# Altium project ALU_Add_Shift.PrjPcb
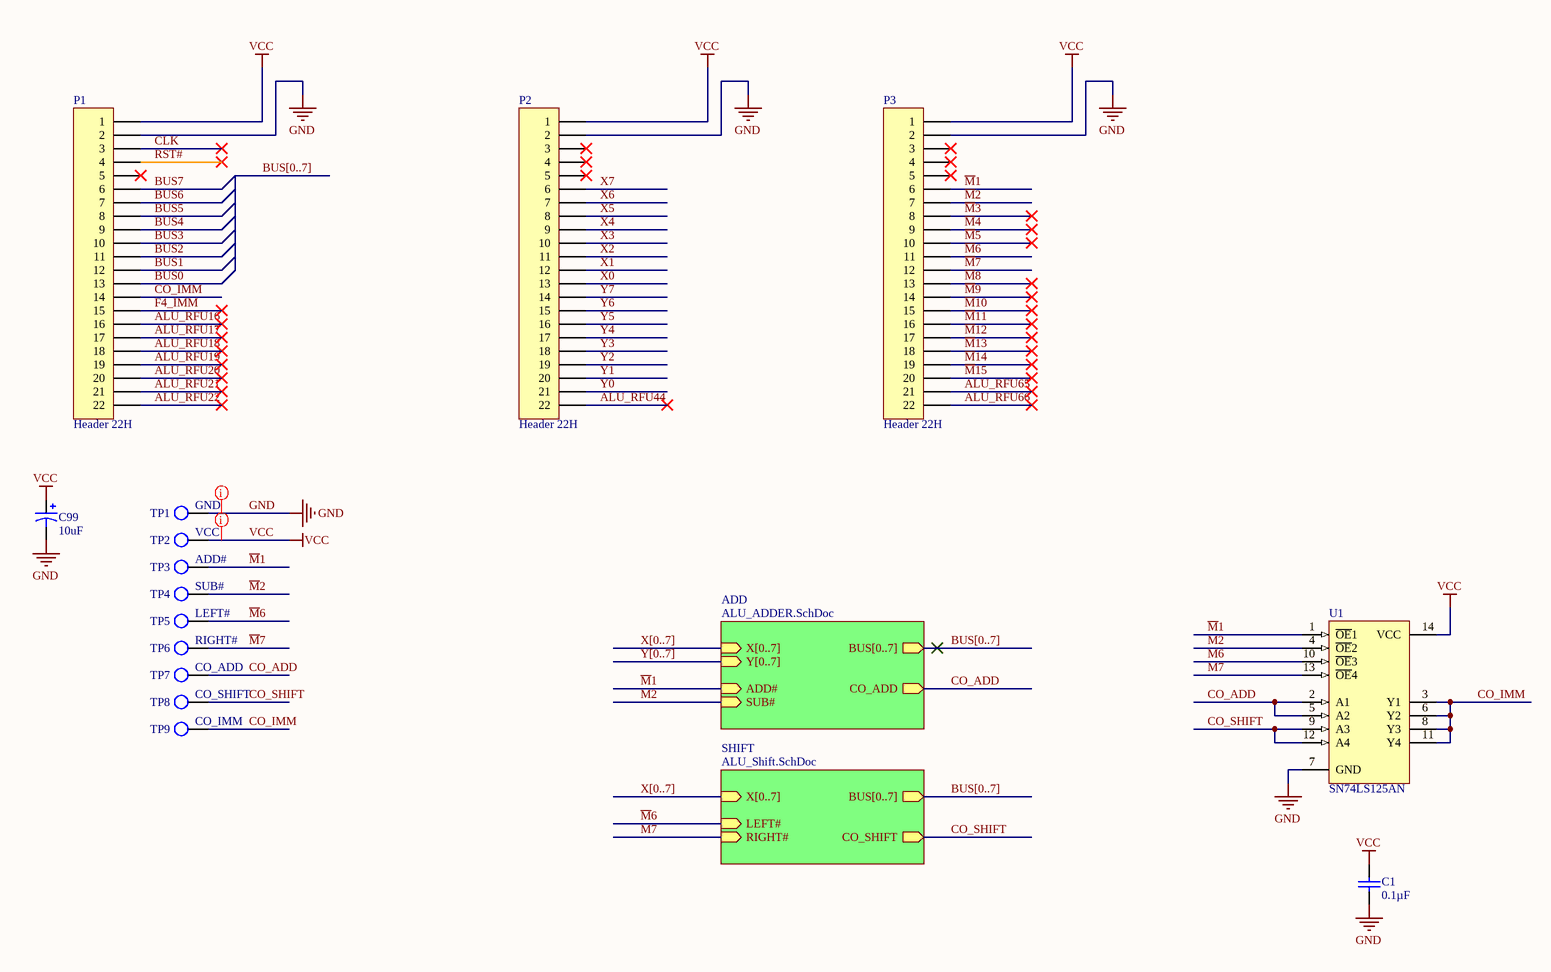
[diagram p0: ALU_Add_Shift.SchDoc]
3 sheets, 43 parts. Net scope: hierarchical (ports join the sheet entries above them; power ports are global).
Board file: ALU_Add_Shift.PcbDoc
Sheets:
  ALU_Add_Shift.SchDoc
    SHIFT = ALU_Shift.SchDoc
    ADD = ALU_ADDER.SchDoc

## Sheet ALU_Add_Shift.SchDoc
size B; Author: E. Sims; Organization: Let's Build Rockets Inc.; SheetNumber: 1; SheetTotal: 3

### Parts
C1  Capacitance: 0.1µF  [VISH-K104K15X7RF5TL2]  (hidden comment: K104K15X7RF5TL2)
C99  value 10uF  [C5x7]  (hidden comment: Cap Pol5)
P1  Header 22H  [HDR1X22H]
P2  Header 22H  [HDR1X22H]
P3  Header 22H  [HDR1X22H]
TP1  GND  [KSTN-5011_V]  (no BOM)
TP2  VCC  [KSTN-5011_V]  (no BOM)
TP3  ADD#  [KSTN-5011_V]  (no BOM)
TP4  SUB#  [KSTN-5011_V]  (no BOM)
TP5  LEFT#  [KSTN-5011_V]  (no BOM)
TP6  RIGHT#  [KSTN-5011_V]  (no BOM)
TP7  CO_ADD  [KSTN-5011_V]  (no BOM)
TP8  CO_SHIFT  [KSTN-5011_V]  (no BOM)
TP9  CO_IMM  [KSTN-5011_V]  (no BOM)
U1  SN74LS125AN  [N014]

### Sub-sheets
ADD = ALU_ADDER.SchDoc: X[0..7] (in), BUS[0..7] (out), CO_ADD (out), SUB# (in), ADD# (in), Y[0..7] (in)
SHIFT = ALU_Shift.SchDoc: X[0..7] (in), BUS[0..7] (out), CO_SHIFT (out), RIGHT# (in), LEFT# (in)

### Nets
GND: C1.2 C99.2 P1.2 P2.2 P3.2 TP1.1 U1.7(GND)
VCC: C1.1 C99.1 P1.1 P2.1 P3.1 TP2.1 U1.14(VCC)
ALU_RFU16: P1.16
ALU_RFU17: P1.17
ALU_RFU18: P1.18
ALU_RFU19: P1.19
ALU_RFU20: P1.20
ALU_RFU21: P1.21
ALU_RFU22: P1.22
ALU_RFU44: P2.22
ALU_RFU65: P3.21
ALU_RFU66: P3.22
BUS0: P1.13
BUS1: P1.12
BUS2: P1.11
BUS3: P1.10
BUS4: P1.9
BUS5: P1.8
BUS6: P1.7
BUS7: P1.6
CLK: P1.3
CO_ADD: TP7.1 U1.2(A1) U1.5(A2) ; sheet ADD/CO_ADD
CO_IMM: P1.14 TP9.1 U1.3(Y1) U1.6(Y2) U1.8(Y3) U1.11(Y4)
CO_SHIFT: TP8.1 U1.9(A3) U1.12(A4) ; sheet SHIFT/CO_SHIFT
F4_IMM: P1.15
~{M}1: P3.6 TP3.1 U1.1(~{OE}1) ; sheet ADD/ADD#  [project net ADD#]
~{M}2: P3.7 TP4.1 U1.4(~{OE}2) ; sheet ADD/SUB#
~{M}3: P3.8
~{M}4: P3.9
~{M}5: P3.10
~{M}6: P3.11 TP5.1 U1.10(~{OE}3) ; sheet SHIFT/LEFT#  [project net LEFT#]
~{M}7: P3.12 TP6.1 U1.13(~{OE}4) ; sheet SHIFT/RIGHT#
~{M}8: P3.13
~{M}9: P3.14
~{M}10: P3.15
~{M}11: P3.16
~{M}12: P3.17
~{M}13: P3.18
~{M}14: P3.19
~{M}15: P3.20
RST#: P1.4
X0: P2.13
X1: P2.12
X2: P2.11
X3: P2.10
X4: P2.9
X5: P2.8
X6: P2.7
X7: P2.6
Y0: P2.21
Y1: P2.20
Y2: P2.19
Y3: P2.18
Y4: P2.17
Y5: P2.16
Y6: P2.15
Y7: P2.14

Not connected (* = marked no-connect by the designer): P1 5*; P2 3* 4* 5*; P3 3* 4* 5*

### Buses and harness runs
bus BUS[0..7]
bus BUS[0..7] = sheet ADD/BUS[0..7]
bus BUS[0..7] = sheet SHIFT/BUS[0..7]
bus X[0..7] = sheet ADD/X[0..7]
bus X[0..7] = sheet SHIFT/X[0..7]
bus Y[0..7] = sheet ADD/Y[0..7]

### Layout directives
rule Width Constraint [Pref Width = 20mil    Min Width = 20mil    Max Width = 50mil]; rule Routing Via Style [Pref Size = 35mil    Pref Hole Size = 20mil]; net class PWR: GND, VCC

### Notes on the sheet
- Let's Build Rocket's Inc. Modular Paylaod System Based on TMP-010 Rev
  For more information visit https://github.com/LetsBuildRockets/Modular-Payload-System
  This work is licensed under CC BY-NC 4.0. To view a copy of this license, visit https://creativecommons.org/licenses/by-nc/4.0
- Title
- Size:
- Date:
- Assembly Variant:
- B
- Number:
- Time:
- Revision:
- Sheet
- of
- Author:
- File:

### Library data of the parts
C1 = CMP-2000-06508-1: Ceramic Capacitor, 100 nF, +/- 10%, 50 V, -55 to 125 degC, 2-Pin THD, RoHS, Tape and Reel; Manufacturer: Vishay; Other Names: BC1084CT; Catalog Drawings: Mono-KapSide2-15_5.58Mono-KapSide1_15; Temperature Coefficient: X7R; Voltage - Rated: 50V; Online Catalog: Mono-Kap™Series; Size / Dimension: 0.157"Lx0.098"W(4.00mmx2.50mm); Operating Temperature: -55°C~125°C; Family: CeramicCapacitors; Manufacturer URL: http://www.vishay.com/; Standard Package: 1; Thickness (Max): -; Ratings: -; Datasheet Version: 08/2013; Package Description: 2-Pin Through Hole Device, Body 4 x 2.6 mm; Mounting Type: ThroughHole; Features: -; Lead Spacing: 0.098"(2.50mm); Tolerance: ±10%; Category: Capacitors; Mounting Technology: ThroughHole; Lead Style: Straight; Datasheet URL: http://www.vishay.com/docs/45171/kseries.pdf; Applications: GeneralPurpose; Package / Case: Radial; Height - Seated (Max): 0.220"(5.58mm); Package Reference: K104K15X7RF5TL2; Series: Mono-Kap™K; Packaging: CutTape(CT)
C99 = Cap Pol5: Polarized Capacitor; Published: 8-Jun-2000; LatestRevisionDate: 17-Jul-2002; LatestRevisionNote: Re-released for DXP Platform.; PackageReference: POLAR0.8; Publisher: Altium Limited; PackageDescription: Polarized Capacitor; 2 Leads
P1-P3 = Header 22H: Header, 22-Pin, Right Angle; System: Connector; LatestRevisionDate: 17-Jul-2002; LatestRevisionNote: Re-released for DXP Platform.; Publisher: Altium Limited
TP1-TP9 = TP
U1 = SN74LS125AN: Quadruple Bus Buffer with 3-State Outputs; Published: 8-Jun-2000; LatestRevisionDate: 06-Jun-2005; LatestRevisionNote: Stylized 3D Model Added.; DatasheetVersion: Mar-1988; PackageVersion: Oct-1995; PackageReference: N014; Publisher: Altium Limited; PackageDescription: DIP; 14 Leads; Row Spacing 7.62 mm; Pitch 2.54 mm; ComponentLink1Description: Manufacturer Link; ComponentLink1URL: http://www.ti.com/; ComponentLink2Description: Datasheet; ComponentLink2URL: http://www-s.ti.com/sc/ds/sn74ls126a.pdf

## Sheet ALU_Shift.SchDoc
size B; Author: E. Sims; Organization: Let's Build Rockets Inc.; SheetNumber: 2; SheetTotal: 3
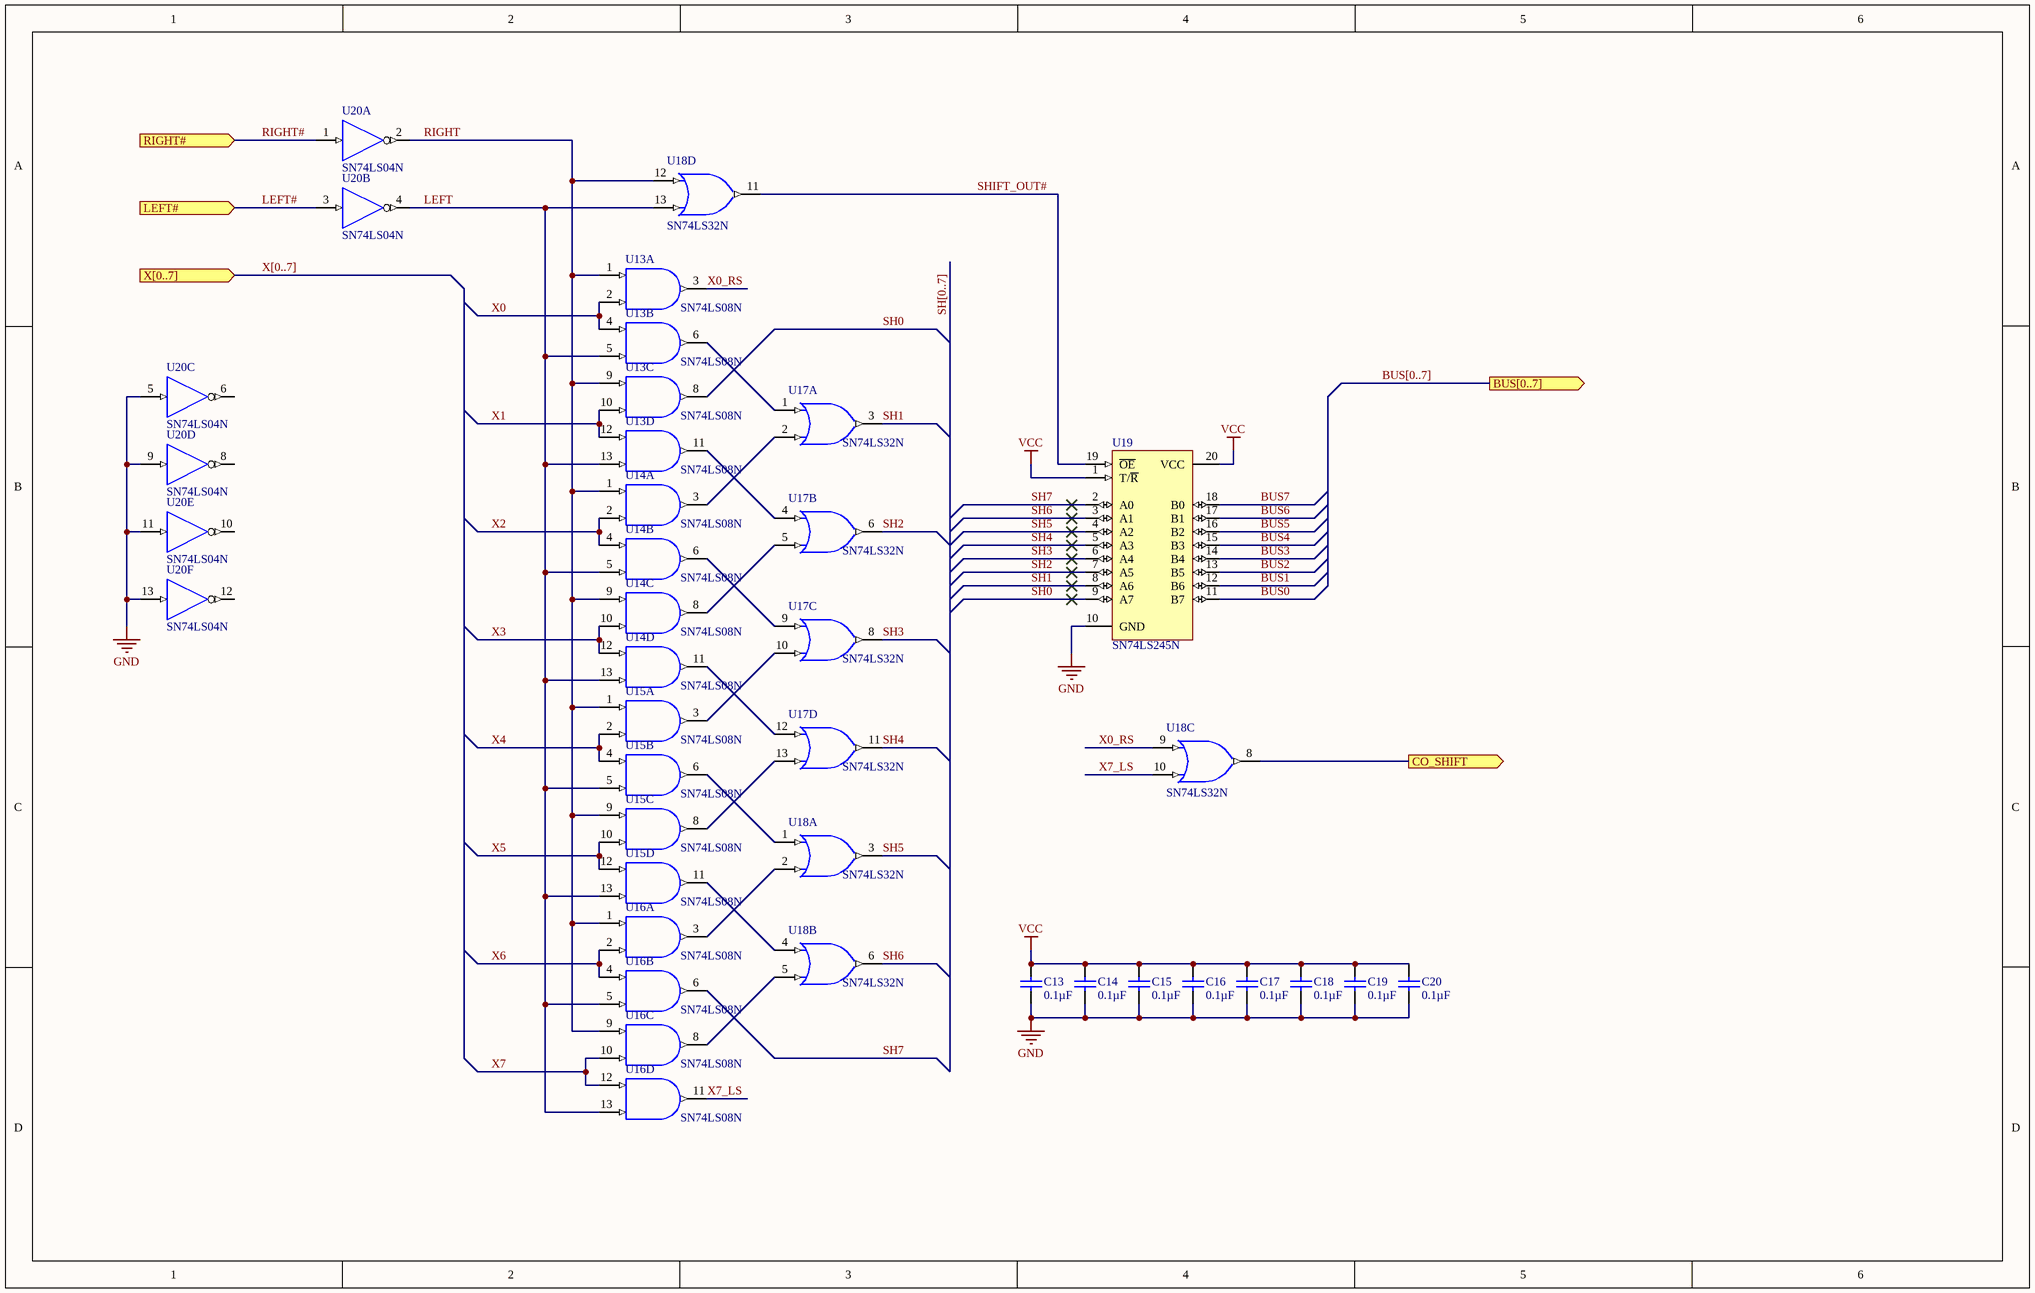
[diagram p1: ALU_Shift.SchDoc]

### Parts
C13  Capacitance: 0.1µF  [VISH-K104K15X7RF5TL2]  (hidden comment: K104K15X7RF5TL2)
C14  Capacitance: 0.1µF  [VISH-K104K15X7RF5TL2]  (hidden comment: K104K15X7RF5TL2)
C15  Capacitance: 0.1µF  [VISH-K104K15X7RF5TL2]  (hidden comment: K104K15X7RF5TL2)
C16  Capacitance: 0.1µF  [VISH-K104K15X7RF5TL2]  (hidden comment: K104K15X7RF5TL2)
C17  Capacitance: 0.1µF  [VISH-K104K15X7RF5TL2]  (hidden comment: K104K15X7RF5TL2)
C18  Capacitance: 0.1µF  [VISH-K104K15X7RF5TL2]  (hidden comment: K104K15X7RF5TL2)
C19  Capacitance: 0.1µF  [VISH-K104K15X7RF5TL2]  (hidden comment: K104K15X7RF5TL2)
C20  Capacitance: 0.1µF  [VISH-K104K15X7RF5TL2]  (hidden comment: K104K15X7RF5TL2)
U13  SN74LS08N  [N014]  (parts A,B,C,D of 4)
U14  SN74LS08N  [N014]  (parts A,B,C,D of 4)
U15  SN74LS08N  [N014]  (parts A,B,C,D of 4)
U16  SN74LS08N  [N014]  (parts A,B,C,D of 4)
U17  SN74LS32N  [N014]  (parts A,B,C,D of 4)
U18  SN74LS32N  [N014]  (parts A,B,C,D of 4)
U19  SN74LS245N  [N020]
U20  SN74LS04N  [N014]  (parts A,B,C,D,E,F of 6)

### Ports
BUS[0..7] (out), CO_SHIFT (out), LEFT# (in), RIGHT# (in), X[0..7] (in)

### Nets
GND: C13.2 C14.2 C15.2 C16.2 C17.2 C18.2 C19.2 C20.2 U13.7(GND) U14.7(GND) U15.7(GND) U16.7(GND) U17.7(GND) U18.7(GND) U19.10(GND) U20.5(A) U20.7(GND) U20.9(A) U20.11(A) U20.13(A)
VCC: C13.1 C14.1 C15.1 C16.1 C17.1 C18.1 C19.1 C20.1 U13.14(VCC) U14.14(VCC) U15.14(VCC) U16.14(VCC) U17.14(VCC) U18.14(VCC) U19.1(T/~{R}) U19.20(VCC) U20.14(VCC)
BUS0: U19.11(B7)
BUS1: U19.12(B6)
BUS2: U19.13(B5)
BUS3: U19.14(B4)
BUS4: U19.15(B3)
BUS5: U19.16(B2)
BUS6: U19.17(B1)
BUS7: U19.18(B0)
CO_SHIFT: U18.8(Y) ; port CO_SHIFT
LEFT: U13.5(B) U13.13(B) U14.5(B) U14.13(B) U15.5(B) U15.13(B) U16.5(B) U16.13(B) U18.13(B) U20.4(Y)
LEFT#: U20.3(A) ; port LEFT#
RIGHT: U13.1(A) U13.9(A) U14.1(A) U14.9(A) U15.1(A) U15.9(A) U16.1(A) U16.9(A) U18.12(A) U20.2(Y)
RIGHT#: U20.1(A) ; port RIGHT#  [project net ~{M}7]
SH0: U13.8(Y) U19.9(A7)
SH1: U17.3(Y) U19.8(A6)
SH2: U17.6(Y) U19.7(A5)
SH3: U17.8(Y) U19.6(A4)
SH4: U17.11(Y) U19.5(A3)
SH5: U18.3(Y) U19.4(A2)
SH6: U18.6(Y) U19.3(A1)
SH7: U16.6(Y) U19.2(A0)
SHIFT_OUT#: U18.11(Y) U19.19(~{OE})
X0: U13.2(B) U13.4(A)
X0_RS: U13.3(Y) U18.9(A)
X1: U13.10(B) U13.12(A)
X2: U14.2(B) U14.4(A)
X3: U14.10(B) U14.12(A)
X4: U15.2(B) U15.4(A)
X5: U15.10(B) U15.12(A)
X6: U16.2(B) U16.4(A)
X7: U16.10(B) U16.12(A)
X7_LS: U16.11(Y) U18.10(B)
NetU13_6: U13.6(Y) U17.1(A)
NetU13_11: U13.11(Y) U17.4(A)
NetU14_3: U14.3(Y) U17.2(B)
NetU14_6: U14.6(Y) U17.9(A)
NetU14_8: U14.8(Y) U17.5(B)
NetU14_11: U14.11(Y) U17.12(A)
NetU15_3: U15.3(Y) U17.10(B)
NetU15_6: U15.6(Y) U18.1(A)
NetU15_8: U15.8(Y) U17.13(B)
NetU15_11: U15.11(Y) U18.4(A)
NetU16_3: U16.3(Y) U18.2(B)
NetU16_8: U16.8(Y) U18.5(B)

Not connected (* = marked no-connect by the designer): U20 6(Y) 8(Y) 10(Y) 12(Y)

### Buses and harness runs
bus BUS[0..7] = port BUS[0..7]
bus SH[0..7]
bus X[0..7] = port X[0..7]

### Notes on the sheet
- Let's Build Rocket's Inc. Modular Paylaod System Based on TMP-010 Rev
  For more information visit https://github.com/LetsBuildRockets/Modular-Payload-System
  This work is licensed under CC BY-NC 4.0. To view a copy of this license, visit https://creativecommons.org/licenses/by-nc/4.0
- Title
- Size:
- Date:
- Assembly Variant:
- B
- Number:
- Time:
- Revision:
- Sheet
- of
- Author:
- File:

### Library data of the parts
C13-C20 = CMP-2000-06508-1: as C1 on sheet ALU_Add_Shift; Size / Dimension: 0.157"Lx0.098"W(4.00mmx2.50mm); Operating Temperature: -55°C~125°C; Family: CeramicCapacitors; Manufacturer URL: http://www.vishay.com/; Standard Package: 1; Thickness (Max): -; Ratings: -; Datasheet Version: 08/2013; Package Description: 2-Pin Through Hole Device, Body 4 x 2.6 mm; Mounting Type: ThroughHole; Features: -; Lead Spacing: 0.098"(2.50mm); Tolerance: ±10%; Category: Capacitors; Mounting Technology: ThroughHole; Lead Style: Straight; Datasheet URL: http://www.vishay.com/docs/45171/kseries.pdf; Applications: GeneralPurpose; Package / Case: Radial; Height - Seated (Max): 0.220"(5.58mm); Package Reference: K104K15X7RF5TL2; Series: Mono-Kap™K; Packaging: CutTape(CT)
U13-U16 = SN74LS08N: Quadruple 2-Input Positive-AND Gate; Published: 8-Jun-2000; LatestRevisionDate: 04-Mar-2005; LatestRevisionNote: Stylized 3D Model Added.; DatasheetVersion: Mar-1988; PackageVersion: Oct-1995; PackageReference: N014; Publisher: Altium Limited; PackageDescription: DIP; 14 Leads; Row Spacing 7.62 mm; Pitch 2.54 mm; ComponentLink1Description: Manufacturer Link; ComponentLink1URL: http://www.ti.com/; ComponentLink2Description: Datasheet; ComponentLink2URL: http://www-s.ti.com/sc/ds/SN74LS08.pdf
U17 U18 = SN74LS32N: Quadruple 2-Input Positive-OR Gate; Published: 8-Jun-2000; LatestRevisionDate: 04-Mar-2005; LatestRevisionNote: Stylized 3D Model Added.; DatasheetVersion: Mar-1988; PackageVersion: Oct-1995; PackageReference: N014; Publisher: Altium Limited; PackageDescription: DIP; 14 Leads; Row Spacing 7.62 mm; Pitch 2.54 mm; ComponentLink1Description: Manufacturer Link; ComponentLink1URL: http://www.ti.com/; ComponentLink2Description: Datasheet; ComponentLink2URL: http://www-s.ti.com/sc/ds/sn74ls32.pdf
U19 = SN74LS245N: Octal Bus Transceiver with 3-State Outputs; Published: 8-Jun-2000; LatestRevisionDate: 04-Mar-2005; LatestRevisionNote: Stylized 3D Model Added.; DatasheetVersion: Mar-1988; PackageVersion: Oct-1995; PackageReference: N020; Publisher: Altium Limited; PackageDescription: DIP; 20 Leads; Row Spacing 7.62 mm; Pitch 2.54 mm; ComponentLink1Description: Manufacturer Link; ComponentLink1URL: http://www.ti.com/; ComponentLink2Description: Datasheet; ComponentLink2URL: http://www-s.ti.com/sc/ds/sn74ls245.pdf
U20 = SN74LS04N: Hex Inverter; Published: 8-Jun-2000; LatestRevisionDate: 04-Mar-2005; LatestRevisionNote: Stylized 3D Model Added.; DatasheetVersion: Mar-1988; PackageVersion: Oct-1995; PackageReference: N014; Publisher: Altium Limited; PackageDescription: DIP; 14 Leads; Row Spacing 7.62 mm; Pitch 2.54 mm; ComponentLink1Description: Manufacturer Link; ComponentLink1URL: http://www.ti.com/; ComponentLink2Description: Datasheet; ComponentLink2URL: http://www-s.ti.com/sc/ds/sn74ls04.pdf

## Sheet ALU_ADDER.SchDoc
size B; Author: E. Sims; Organization: Let's Build Rockets Inc.; SheetNumber: 3; SheetTotal: 3
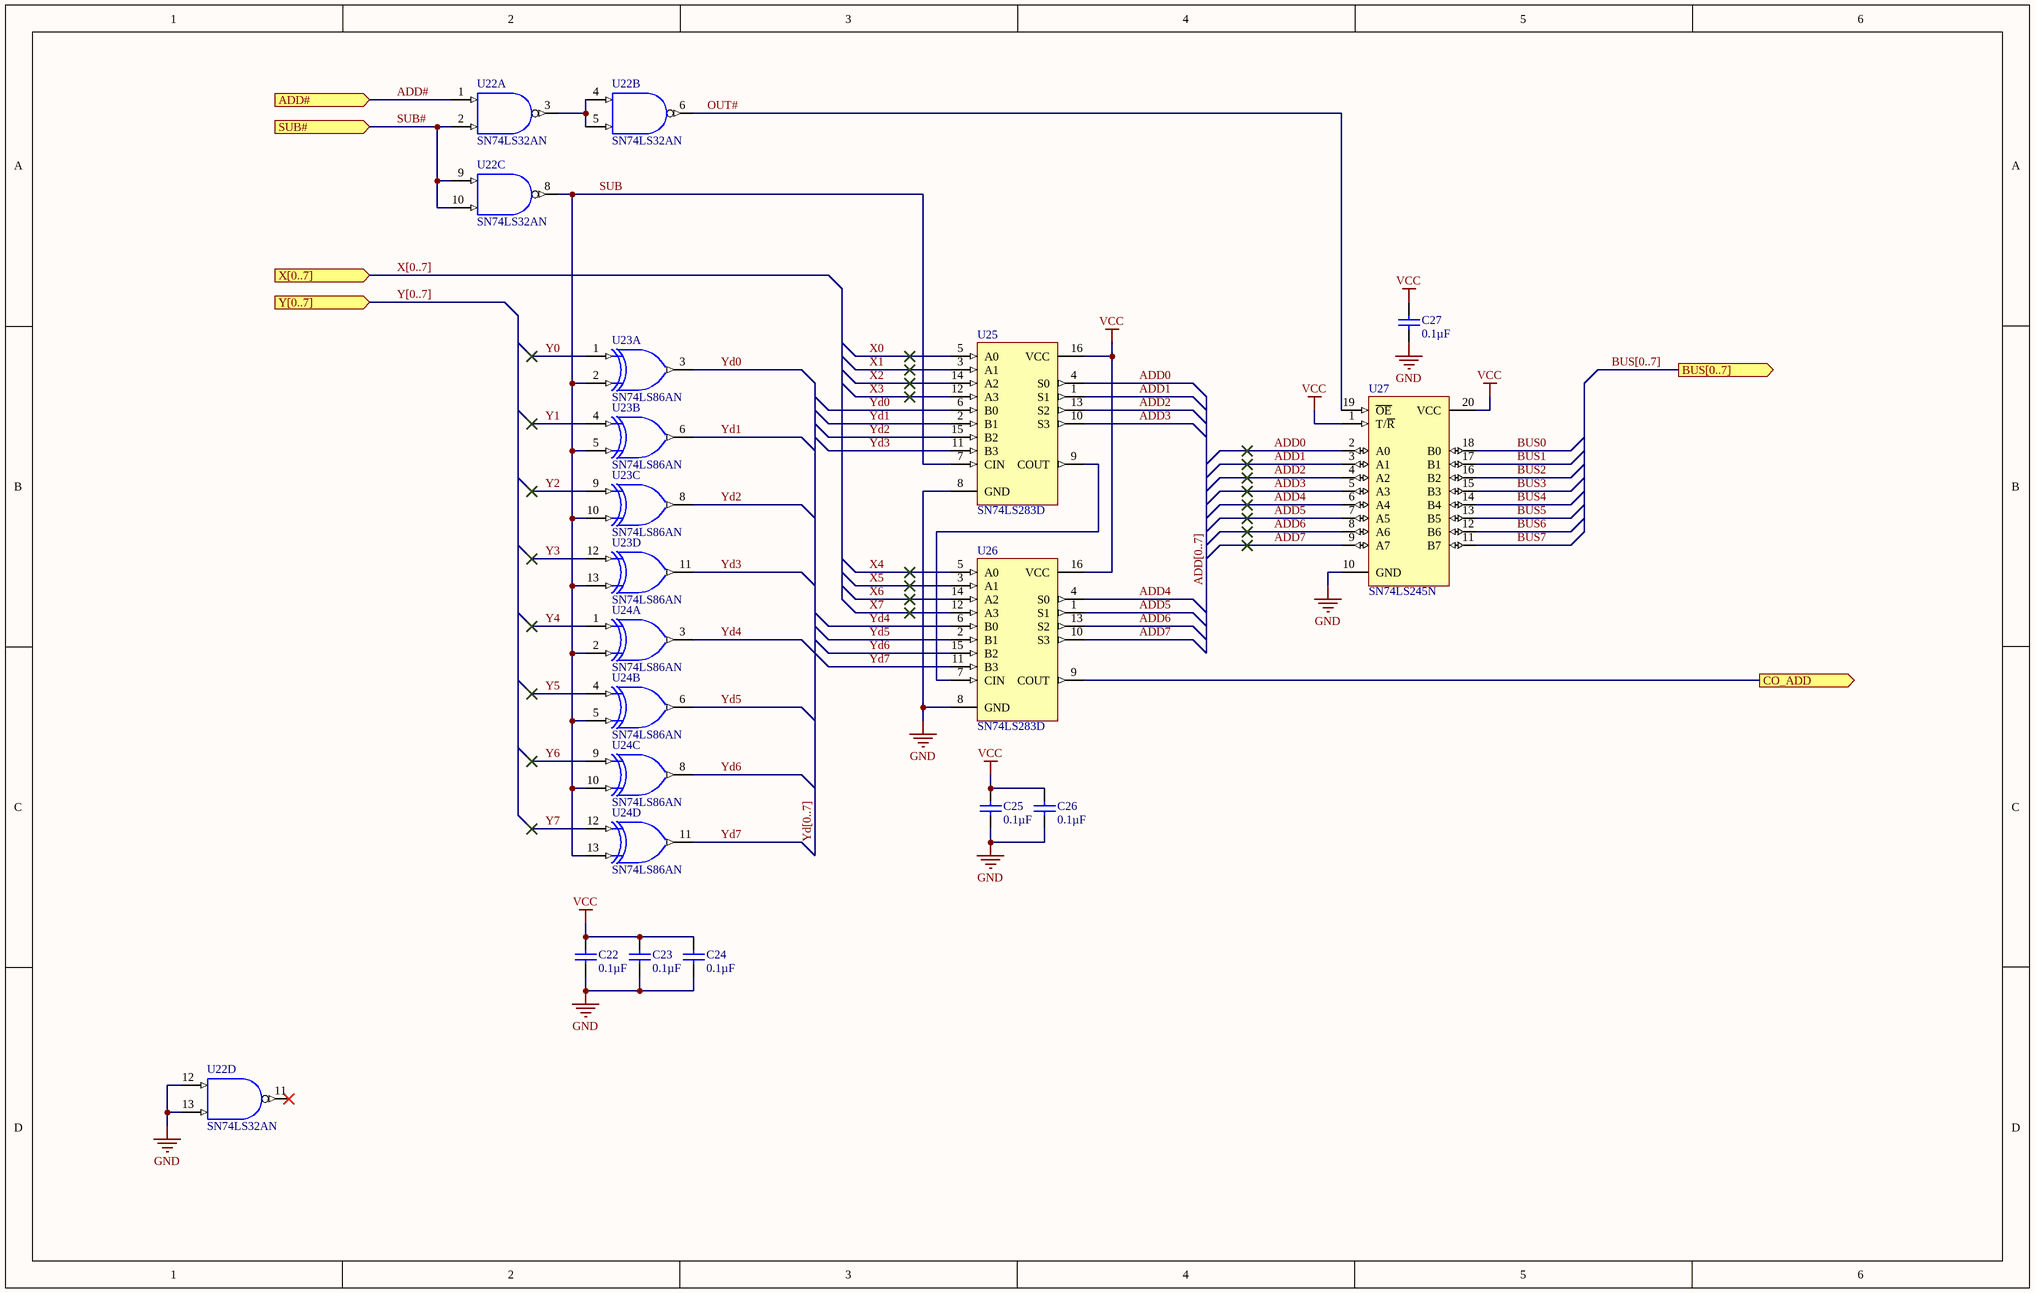
[diagram p2: ALU_ADDER.SchDoc]

### Parts
C22  Capacitance: 0.1µF  [VISH-K104K15X7RF5TL2]  (hidden comment: K104K15X7RF5TL2)
C23  Capacitance: 0.1µF  [VISH-K104K15X7RF5TL2]  (hidden comment: K104K15X7RF5TL2)
C24  Capacitance: 0.1µF  [VISH-K104K15X7RF5TL2]  (hidden comment: K104K15X7RF5TL2)
C25  Capacitance: 0.1µF  [VISH-K104K15X7RF5TL2]  (hidden comment: K104K15X7RF5TL2)
C26  Capacitance: 0.1µF  [VISH-K104K15X7RF5TL2]  (hidden comment: K104K15X7RF5TL2)
C27  Capacitance: 0.1µF  [VISH-K104K15X7RF5TL2]  (hidden comment: K104K15X7RF5TL2)
U22  SN74LS32AN  [N014]  (parts A,B,C,D of 4)
U23  SN74LS86AN  [N014]  (parts A,B,C,D of 4)
U24  SN74LS86AN  [N014]  (parts A,B,C,D of 4)
U25  SN74LS283D  [J016D]
U26  SN74LS283D  [J016D]
U27  SN74LS245N  [N020]

### Ports
ADD# (in), BUS[0..7] (out), CO_ADD (out), SUB# (in), X[0..7] (in), Y[0..7] (in)

### Nets
GND: C22.2 C23.2 C24.2 C25.2 C26.2 C27.2 U22.7(GND) U22.12(A) U22.13(B) U23.7(GND) U24.7(GND) U25.8(GND) U26.8(GND) U27.10(GND)
VCC: C22.1 C23.1 C24.1 C25.1 C26.1 C27.1 U22.14(VCC) U23.14(VCC) U24.14(VCC) U25.16(VCC) U26.16(VCC) U27.1(T/~{R}) U27.20(VCC)
ADD0: U25.4(S0) U27.2(A0)
ADD1: U25.1(S1) U27.3(A1)
ADD2: U25.13(S2) U27.4(A2)
ADD3: U25.10(S3) U27.5(A3)
ADD4: U26.4(S0) U27.6(A4)
ADD5: U26.1(S1) U27.7(A5)
ADD6: U26.13(S2) U27.8(A6)
ADD7: U26.10(S3) U27.9(A7)
ADD#: U22.1(A) ; port ADD#
BUS0: U27.18(B0)
BUS1: U27.17(B1)
BUS2: U27.16(B2)
BUS3: U27.15(B3)
BUS4: U27.14(B4)
BUS5: U27.13(B5)
BUS6: U27.12(B6)
BUS7: U27.11(B7)
CO_ADD: U26.9(COUT) ; port CO_ADD
OUT#: U22.6(Y) U27.19(~{OE})
SUB: U22.8(Y) U23.2(B) U23.5(B) U23.10(B) U23.13(B) U24.2(B) U24.5(B) U24.10(B) U24.13(B) U25.7(CIN)
SUB#: U22.2(B) U22.9(A) U22.10(B) ; port SUB#  [project net ~{M}2]
X0: U25.5(A0)
X1: U25.3(A1)
X2: U25.14(A2)
X3: U25.12(A3)
X4: U26.5(A0)
X5: U26.3(A1)
X6: U26.14(A2)
X7: U26.12(A3)
Y0: U23.1(A)
Y1: U23.4(A)
Y2: U23.9(A)
Y3: U23.12(A)
Y4: U24.1(A)
Y5: U24.4(A)
Y6: U24.9(A)
Y7: U24.12(A)
Yd0: U23.3(Y) U25.6(B0)
Yd1: U23.6(Y) U25.2(B1)
Yd2: U23.8(Y) U25.15(B2)
Yd3: U23.11(Y) U25.11(B3)
Yd4: U24.3(Y) U26.6(B0)
Yd5: U24.6(Y) U26.2(B1)
Yd6: U24.8(Y) U26.15(B2)
Yd7: U24.11(Y) U26.11(B3)
NetU22_3: U22.3(Y) U22.4(A) U22.5(B)
NetU25_9: U25.9(COUT) U26.7(CIN)

Not connected (* = marked no-connect by the designer): U22 11(Y)*

### Buses and harness runs
bus ADD[0..7]
bus BUS[0..7] = port BUS[0..7]
bus X[0..7] = port X[0..7]
bus Y[0..7] = port Y[0..7]
bus Yd[0..7]

### Notes on the sheet
- Let's Build Rocket's Inc. Modular Paylaod System Based on TMP-010 Rev
  For more information visit https://github.com/LetsBuildRockets/Modular-Payload-System
  This work is licensed under CC BY-NC 4.0. To view a copy of this license, visit https://creativecommons.org/licenses/by-nc/4.0
- Title
- Size:
- Date:
- Assembly Variant:
- B
- Number:
- Time:
- Revision:
- Sheet
- of
- Author:
- File:

### Library data of the parts
C22-C27 = CMP-2000-06508-1: as C1 on sheet ALU_Add_Shift; Size / Dimension: 0.157"Lx0.098"W(4.00mmx2.50mm); Operating Temperature: -55°C~125°C; Family: CeramicCapacitors; Manufacturer URL: http://www.vishay.com/; Standard Package: 1; Thickness (Max): -; Ratings: -; Datasheet Version: 08/2013; Package Description: 2-Pin Through Hole Device, Body 4 x 2.6 mm; Mounting Type: ThroughHole; Features: -; Lead Spacing: 0.098"(2.50mm); Tolerance: ±10%; Category: Capacitors; Mounting Technology: ThroughHole; Lead Style: Straight; Datasheet URL: http://www.vishay.com/docs/45171/kseries.pdf; Applications: GeneralPurpose; Package / Case: Radial; Height - Seated (Max): 0.220"(5.58mm); Package Reference: K104K15X7RF5TL2; Series: Mono-Kap™K; Packaging: CutTape(CT)
U22 = SN74LS00N: Quadruple 2-Input Positive-NAND Gate; Published: 8-Jun-2000; LatestRevisionDate: 04-Mar-2005; LatestRevisionNote: Stylized 3D Model Added.; DatasheetVersion: Mar-1988; PackageVersion: Oct-1995; PackageReference: N014; Publisher: Altium Limited; PackageDescription: DIP; 14 Leads; Row Spacing 7.62 mm; Pitch 2.54 mm; ComponentLink1Description: Manufacturer Link; ComponentLink1URL: http://www.ti.com/; ComponentLink2Description: Datasheet; ComponentLink2URL: http://www-s.ti.com/sc/ds/sn74ls00.pdf
U23 U24 = SN74LS86AN: Quadruple 2-Input Exclusive-OR Gate; Published: 8-Jun-2000; LatestRevisionDate: 04-Mar-2005; LatestRevisionNote: Stylized 3D Model Added.; DatasheetVersion: Mar-1988; PackageVersion: Oct-1995; PackageReference: N014; Publisher: Altium Limited; PackageDescription: DIP; 14 Leads; Row Spacing 7.62 mm; Pitch 2.54 mm; ComponentLink1Description: Manufacturer Link; ComponentLink1URL: http://www.ti.com/; ComponentLink2Description: Datasheet; ComponentLink2URL: http://www-s.ti.com/sc/ds/sn74ls86a.pdf
U25 U26 = SN74LS283D: 4-Bit Binary Full Adder with Fast Carry; Published: 8-Jun-2000; LatestRevisionDate: 04-Mar-2005; LatestRevisionNote: Stylized 3D Model Added.; DatasheetVersion: Mar-1988; PackageVersion: Jun-1999; PackageReference: J016D; Publisher: Altium Limited; PackageDescription: DIP; 16 Leads; Row Spacing 7.62 mm; Pitch 2.54 mm; ComponentLink1Description: Manufacturer Link; ComponentLink1URL: http://www.ti.com; ComponentLink2Description: Datasheet; ComponentLink2URL: http://www-s.ti.com/sc/ds/sn54ls283.pdf
U27 = SN74LS245N: as U19 on sheet ALU_Shift; Published: 8-Jun-2000; LatestRevisionDate: 04-Mar-2005; LatestRevisionNote: Stylized 3D Model Added.; DatasheetVersion: Mar-1988; PackageVersion: Oct-1995; PackageReference: N020; Publisher: Altium Limited; PackageDescription: DIP; 20 Leads; Row Spacing 7.62 mm; Pitch 2.54 mm; ComponentLink1Description: Manufacturer Link; ComponentLink1URL: http://www.ti.com/; ComponentLink2Description: Datasheet; ComponentLink2URL: http://www-s.ti.com/sc/ds/sn74ls245.pdf

## Nets that join several sheets
GND: ALU_Add_Shift (7 pins), ALU_Shift (20 pins), ALU_ADDER (14 pins)
VCC: ALU_Add_Shift (7 pins), ALU_Shift (17 pins), ALU_ADDER (13 pins)
ADD#: ALU_Add_Shift (P3.6 TP3.1 U1.1), ALU_ADDER (U22.1)
BUS0: ALU_Add_Shift (P1.13), ALU_Shift (U19.11), ALU_ADDER (U27.18)
BUS1: ALU_Add_Shift (P1.12), ALU_Shift (U19.12), ALU_ADDER (U27.17)
BUS2: ALU_Add_Shift (P1.11), ALU_Shift (U19.13), ALU_ADDER (U27.16)
BUS3: ALU_Add_Shift (P1.10), ALU_Shift (U19.14), ALU_ADDER (U27.15)
BUS4: ALU_Add_Shift (P1.9), ALU_Shift (U19.15), ALU_ADDER (U27.14)
BUS5: ALU_Add_Shift (P1.8), ALU_Shift (U19.16), ALU_ADDER (U27.13)
BUS6: ALU_Add_Shift (P1.7), ALU_Shift (U19.17), ALU_ADDER (U27.12)
BUS7: ALU_Add_Shift (P1.6), ALU_Shift (U19.18), ALU_ADDER (U27.11)
CO_ADD: ALU_Add_Shift (TP7.1 U1.2 U1.5), ALU_ADDER (U26.9)
CO_SHIFT: ALU_Add_Shift (TP8.1 U1.9 U1.12), ALU_Shift (U18.8)
LEFT#: ALU_Add_Shift (P3.11 TP5.1 U1.10), ALU_Shift (U20.3)
~{M}2: ALU_Add_Shift (P3.7 TP4.1 U1.4), ALU_ADDER (U22.2 U22.9 U22.10)
~{M}7: ALU_Add_Shift (P3.12 TP6.1 U1.13), ALU_Shift (U20.1)
X0: ALU_Add_Shift (P2.13), ALU_Shift (U13.2 U13.4), ALU_ADDER (U25.5)
X1: ALU_Add_Shift (P2.12), ALU_Shift (U13.10 U13.12), ALU_ADDER (U25.3)
X2: ALU_Add_Shift (P2.11), ALU_Shift (U14.2 U14.4), ALU_ADDER (U25.14)
X3: ALU_Add_Shift (P2.10), ALU_Shift (U14.10 U14.12), ALU_ADDER (U25.12)
X4: ALU_Add_Shift (P2.9), ALU_Shift (U15.2 U15.4), ALU_ADDER (U26.5)
X5: ALU_Add_Shift (P2.8), ALU_Shift (U15.10 U15.12), ALU_ADDER (U26.3)
X6: ALU_Add_Shift (P2.7), ALU_Shift (U16.2 U16.4), ALU_ADDER (U26.14)
X7: ALU_Add_Shift (P2.6), ALU_Shift (U16.10 U16.12), ALU_ADDER (U26.12)
Y0: ALU_Add_Shift (P2.21), ALU_ADDER (U23.1)
Y1: ALU_Add_Shift (P2.20), ALU_ADDER (U23.4)
Y2: ALU_Add_Shift (P2.19), ALU_ADDER (U23.9)
Y3: ALU_Add_Shift (P2.18), ALU_ADDER (U23.12)
Y4: ALU_Add_Shift (P2.17), ALU_ADDER (U24.1)
Y5: ALU_Add_Shift (P2.16), ALU_ADDER (U24.4)
Y6: ALU_Add_Shift (P2.15), ALU_ADDER (U24.9)
Y7: ALU_Add_Shift (P2.14), ALU_ADDER (U24.12)